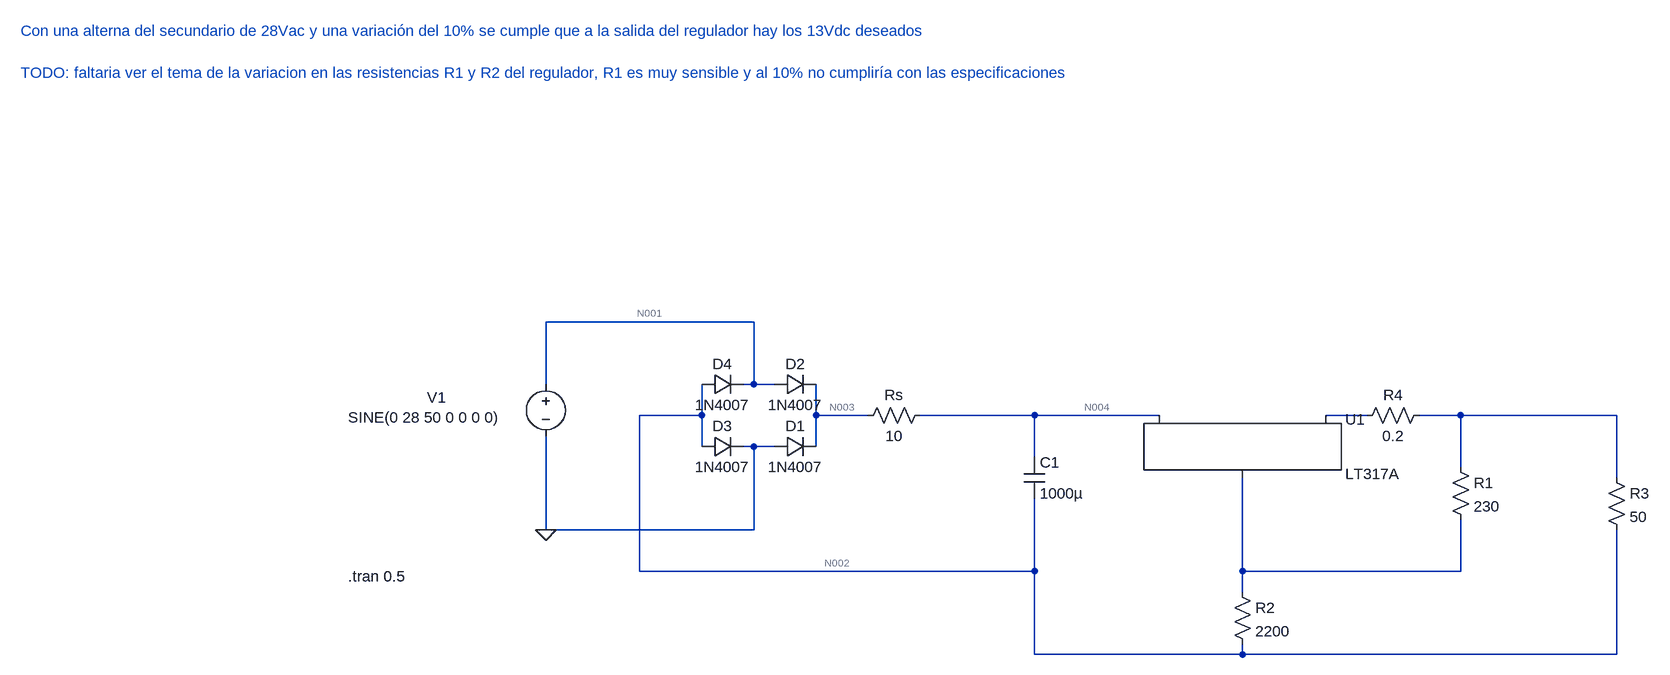
[diagram p0: schematic ReguladorLM317.asc]
ReguladorLM317.asc, the LTspice schematic file:
Version 4
SHEET 1 1448 680
WIRE 32 16 -288 16
WIRE -288 112 -288 16
WIRE 32 112 32 16
WIRE 32 112 16 112
WIRE 64 112 32 112
WIRE -48 160 -48 112
WIRE -48 160 -144 160
WIRE 128 160 128 112
WIRE 208 160 128 160
WIRE 464 160 288 160
WIRE 656 160 464 160
WIRE 976 160 912 160
WIRE 1120 160 1056 160
WIRE 1360 160 1120 160
WIRE -48 208 -48 160
WIRE 32 208 16 208
WIRE 64 208 32 208
WIRE 128 208 128 160
WIRE 464 224 464 160
WIRE 1120 240 1120 160
WIRE 1360 256 1360 160
WIRE -288 336 -288 192
WIRE 32 336 32 208
WIRE 32 336 -288 336
WIRE -144 400 -144 160
WIRE 464 400 464 288
WIRE 464 400 -144 400
WIRE 784 400 784 256
WIRE 1120 400 1120 320
WIRE 1120 400 784 400
WIRE 784 432 784 400
WIRE 464 528 464 400
WIRE 784 528 784 512
WIRE 784 528 464 528
WIRE 1360 528 1360 336
WIRE 1360 528 784 528
FLAG -288 336 0
SYMBOL voltage -288 96 R0
WINDOW 0 -183 36 Left 2
WINDOW 3 -304 67 Left 2
WINDOW 123 0 0 Left 0
WINDOW 39 0 0 Left 0
SYMATTR InstName V1
SYMATTR Value SINE(0 28 50 0 0 0 0)
SYMBOL diode 64 128 R270
WINDOW 0 32 32 VTop 2
WINDOW 3 0 32 VBottom 2
SYMATTR InstName D2
SYMATTR Value 1N4007
SYMBOL cap 448 224 R0
SYMATTR InstName C1
SYMATTR Value 1000µ
SYMBOL PowerProducts\\LT317A 784 160 R0
SYMATTR InstName U1
SYMBOL res 1104 224 R0
SYMATTR InstName R1
SYMATTR Value 230
SYMBOL res 768 416 R0
SYMATTR InstName R2
SYMATTR Value 2200
SYMBOL res 1344 240 R0
SYMATTR InstName R3
SYMATTR Value 50
SYMBOL res 1072 144 R90
WINDOW 0 0 56 VBottom 2
WINDOW 3 32 56 VTop 2
SYMATTR InstName R4
SYMATTR Value 0.2
SYMBOL res 304 144 R90
WINDOW 0 0 56 VBottom 2
WINDOW 3 32 56 VTop 2
SYMATTR InstName Rs
SYMATTR Value 10
SYMBOL diode 64 224 R270
WINDOW 0 32 32 VTop 2
WINDOW 3 0 32 VBottom 2
SYMATTR InstName D1
SYMATTR Value 1N4007
SYMBOL diode -48 224 R270
WINDOW 0 32 32 VTop 2
WINDOW 3 0 32 VBottom 2
SYMATTR InstName D3
SYMATTR Value 1N4007
SYMBOL diode -48 128 R270
WINDOW 0 32 32 VTop 2
WINDOW 3 0 32 VBottom 2
SYMATTR InstName D4
SYMATTR Value 1N4007
TEXT -592 408 Left 2 !.tran 0.5
TEXT -1096 -432 Left 2 ;Con una alterna del secundario de 28Vac y una variación del 10% se cumple que a la salida del regulador hay los 13Vdc deseados
TEXT -1096 -368 Left 2 ;TODO: faltaria ver el tema de la variacion en las resistencias R1 y R2 del regulador, R1 es muy sensible y al 10% no cumpliría con las especificaciones

The netlist it stands for:
* ReguladorLM317.asc
V1 N001 0 SINE(0 28 50 0 0 0 0)
D2 N001 N003 1N4007
C1 N004 N002 1000µ
XU1 N007 N005 N004 LT317A
R1 N006 N007 230
R2 N007 N002 2200
R3 N006 N002 50
R4 N006 N005 0.2
Rs N004 N003 10
D1 0 N003 1N4007
D3 N002 0 1N4007
D4 N002 N001 1N4007
.model D D
.lib standard.dio
.tran 0.5
* Con una alterna del secundario de 28Vac y una variación del 10% se cumple que a la salida del regulador hay los 13Vdc deseados
* TODO: faltaria ver el tema de la variacion en las resistencias R1 y R2 del regulador, R1 es muy sensible y al 10% no cumpliría con las especificaciones
.lib LTC.lib
.backanno
.end

* Results of the author's LTspice run, read from the files saved beside the schematic
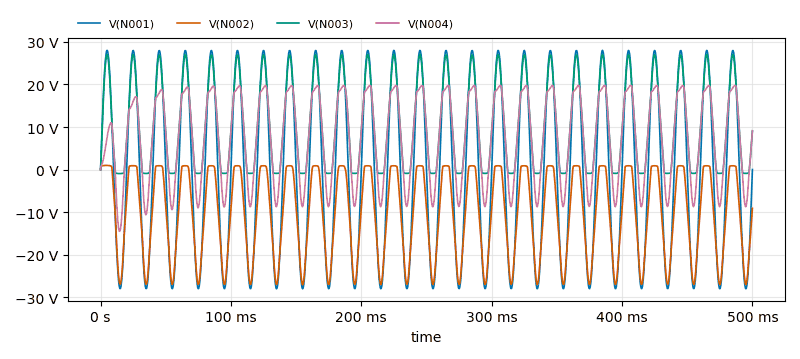
[diagram p1: Transient Analysis of ReguladorLM317.asc, plotted from the saved traces]
* Transient Analysis, 1 run:
*   V(N001): min -28 V, max 28 V, average -38.03 µV, rms 19.8 V, last 0 V
*   V(N002): min -27.03 V, max 979 mV, average -10.29 V, rms 14.36 V, last -9.109 V
*   V(N003): min -938.6 mV, max 27.03 V, average 10.32 V, rms 14.37 V, last 9.109 V
*   V(N004): min -14.5 V, max 19.76 V, average 7.433 V, rms 12.46 V, last 9.108 V